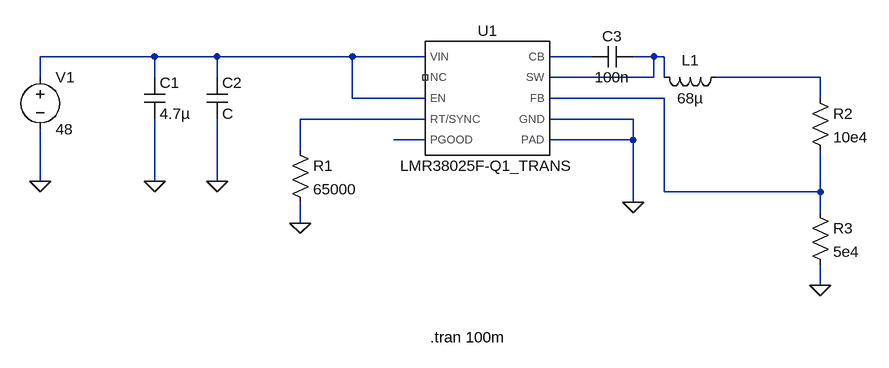
[diagram p0: schematic Draft1.asc]
Draft1.asc, the LTspice schematic file:
Version 4.1
SHEET 1 880 680
WIRE -288 112 -464 112
WIRE -192 112 -288 112
WIRE 16 112 -192 112
WIRE 128 112 16 112
WIRE 384 112 320 112
WIRE 480 112 448 112
WIRE 496 112 480 112
WIRE -464 144 -464 112
WIRE -288 144 -288 112
WIRE -192 144 -192 112
WIRE 480 144 480 112
WIRE 480 144 320 144
WIRE 496 144 496 112
WIRE 736 144 576 144
WIRE 16 176 16 112
WIRE 128 176 16 176
WIRE 496 176 320 176
WIRE 736 176 736 144
WIRE 128 208 -64 208
WIRE 448 208 320 208
WIRE 128 240 80 240
WIRE 448 240 448 208
WIRE 448 240 320 240
WIRE -64 256 -64 208
WIRE -464 304 -464 224
WIRE -288 304 -288 208
WIRE -192 304 -192 208
WIRE 496 320 496 176
WIRE 736 320 736 256
WIRE 736 320 496 320
WIRE 448 336 448 240
WIRE 736 352 736 320
WIRE -64 368 -64 336
WIRE 736 464 736 432
FLAG -288 304 0
FLAG -464 304 0
FLAG -64 368 0
FLAG -192 304 0
FLAG 736 464 0
FLAG 448 336 0
SYMBOL LMR38025F-Q1_TRANS 224 176 R0
SYMATTR InstName U1
SYMBOL cap -304 144 R0
SYMATTR InstName C1
SYMATTR Value 4.7µ
SYMBOL voltage -464 128 R0
WINDOW 123 0 0 Left 0
WINDOW 39 0 0 Left 0
SYMATTR InstName V1
SYMATTR Value 48
SYMBOL res -80 240 R0
SYMATTR InstName R1
SYMATTR Value 65000
SYMBOL cap -208 144 R0
SYMATTR InstName C2
SYMBOL ind 592 128 R90
WINDOW 0 5 56 VBottom 2
WINDOW 3 32 56 VTop 2
SYMATTR InstName L1
SYMATTR Value 68µ
SYMBOL res 720 160 R0
SYMATTR InstName R2
SYMATTR Value 10e4
SYMBOL res 720 336 R0
SYMATTR InstName R3
SYMATTR Value 5e4
SYMBOL cap 448 96 R90
WINDOW 0 0 32 VBottom 2
WINDOW 3 32 32 VTop 2
SYMATTR InstName C3
SYMATTR Value 100n
TEXT 136 544 Left 2 !.tran 100m

The netlist it stands for:
* Draft1.asc
X§U1 N001 NC_01 N001 N006 N007 N002 N003 N005 0 0 LMR38025F-Q1_TRANS  ; pins VIN NC EN RT/SYNC PGOOD CB SW FB GND PAD
C1 N001 0 4.7µ
V1 N001 0 48
R1 N006 0 65000
C2 N001 0 C
L1 N004 N003 68µ
R2 N004 N005 10e4
R3 N005 0 5e4
C3 N003 N002 100n
.tran 100m
.lib LMR38025F-Q1_TRANS.lib
.backanno
.end